# Altium schematic sheet Main.SchDoc
size A
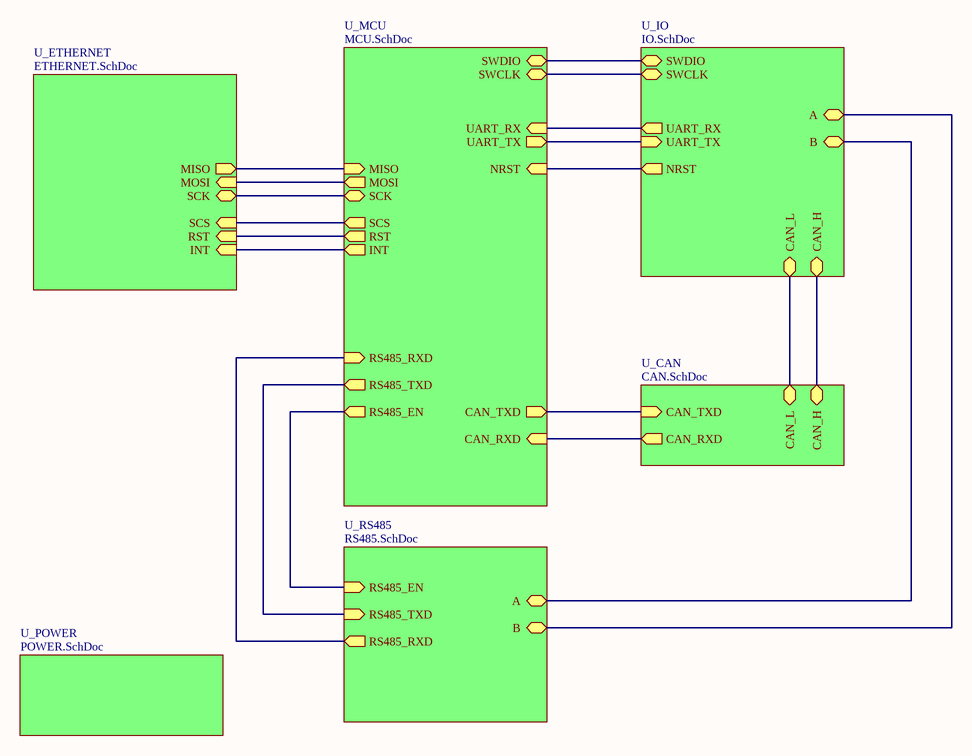
[diagram p0: Main.SchDoc]

## Sub-sheets
U_CAN = CAN.SchDoc: CAN_TXD (in), CAN_RXD (out), CAN_H (bidir), CAN_L (bidir)
U_ETHERNET = ETHERNET.SchDoc: RST (in), INT (in), SCS (in), SCK (bidir), MISO (out), MOSI (in)
U_IO = IO.SchDoc: SWDIO (bidir), SWCLK (bidir), UART_TX (in), UART_RX (out), CAN_H (bidir), CAN_L (bidir), NRST (out), A (bidir), B (bidir)
U_MCU = MCU.SchDoc: SWDIO (bidir), SWCLK (bidir), UART_RX (in), UART_TX (out), SCK (bidir), MISO (in), MOSI (out), SCS (out), RST (out), INT (out), CAN_TXD (out), CAN_RXD (in), NRST (in), RS485_RXD (in), RS485_TXD (out), RS485_EN (out)
U_POWER = POWER.SchDoc: no entries
U_RS485 = RS485.SchDoc: RS485_RXD (out), RS485_TXD (in), RS485_EN (in), A (bidir), B (bidir)

## Nets
(unnamed): sheet U_CAN/CAN_TXD, sheet U_MCU/CAN_TXD
(unnamed): sheet U_CAN/CAN_RXD, sheet U_MCU/CAN_RXD
(unnamed): sheet U_CAN/CAN_H, sheet U_IO/CAN_H
(unnamed): sheet U_CAN/CAN_L, sheet U_IO/CAN_L
(unnamed): sheet U_MCU/SWDIO, sheet U_IO/SWDIO
(unnamed): sheet U_MCU/SWCLK, sheet U_IO/SWCLK
(unnamed): sheet U_MCU/UART_RX, sheet U_IO/UART_RX
(unnamed): sheet U_MCU/UART_TX, sheet U_IO/UART_TX
(unnamed): sheet U_MCU/SCK, sheet U_ETHERNET/SCK
(unnamed): sheet U_MCU/MISO, sheet U_ETHERNET/MISO
(unnamed): sheet U_MCU/MOSI, sheet U_ETHERNET/MOSI
(unnamed): sheet U_MCU/SCS, sheet U_ETHERNET/SCS
(unnamed): sheet U_MCU/RST, sheet U_ETHERNET/RST
(unnamed): sheet U_MCU/INT, sheet U_ETHERNET/INT
(unnamed): sheet U_MCU/NRST, sheet U_IO/NRST
(unnamed): sheet U_MCU/RS485_RXD, sheet U_RS485/RS485_RXD
(unnamed): sheet U_MCU/RS485_TXD, sheet U_RS485/RS485_TXD
(unnamed): sheet U_MCU/RS485_EN, sheet U_RS485/RS485_EN
(unnamed): sheet U_IO/A, sheet U_RS485/B
(unnamed): sheet U_IO/B, sheet U_RS485/A